# Altium schematic sheet Connector.SchDoc
size A4; SheetNumber: 4; SheetTotal: 6
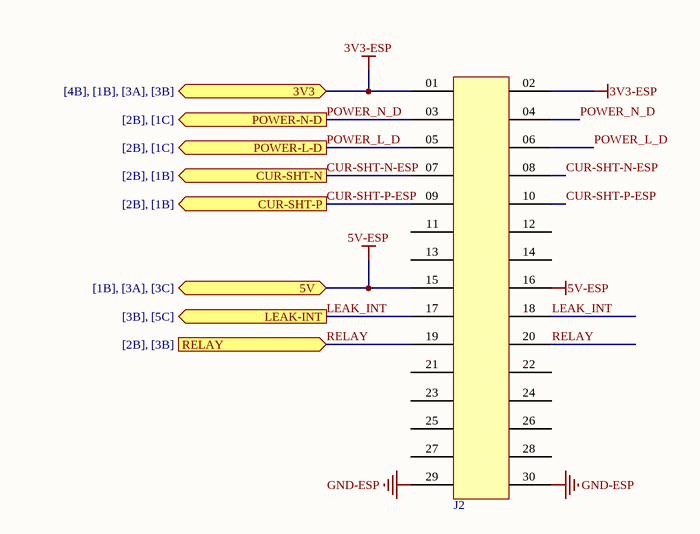
[diagram p0: Connector.SchDoc]

## Parts
J2  HEADER; 15x2PIN; 2.54; HOR;  [HEADER-2.54-15x2-HOR-U3D]  (value not drawn)

## Ports
3V3 (bidir, see [4B], [1B], [3A], [3B]), 5V (bidir, see [1B], [3A], [3C]), CUR-SHT-N (out, see [2B], [1B]), CUR-SHT-P (out, see [2B], [1B]), LEAK-INT (out, see [3B], [5C]), POWER-L-D (out, see [2B], [1C]), POWER-N-D (out, see [2B], [1C]), RELAY (in, see [2B], [3B])

## Nets
3V3-ESP: J2.01 J2.02 ; port 3V3
5V-ESP: J2.15 J2.16 ; port 5V
GND-ESP: J2.29 J2.30
CUR-SHT-N-ESP: J2.07 J2.08 ; port CUR-SHT-N
CUR-SHT-P-ESP: J2.09 J2.10 ; port CUR-SHT-P
LEAK_INT: J2.17 J2.18 ; port LEAK-INT
POWER_L_D: J2.05 J2.06 ; port POWER-L-D
POWER_N_D: J2.03 J2.04 ; port POWER-N-D
RELAY: J2.19 J2.20 ; port RELAY

Not connected (* = marked no-connect by the designer): J2 11 12 13 14 21 22 23 24 25 26 27 28

## Library data of the parts
J2 = HEADER; 15x2PIN; 2.54; HOR;: Designer: TVBac; System: Connector